# Altium schematic sheet 密码球锁202061.Schdoc
size A2; SheetNumber: 0; SheetTotal: 0
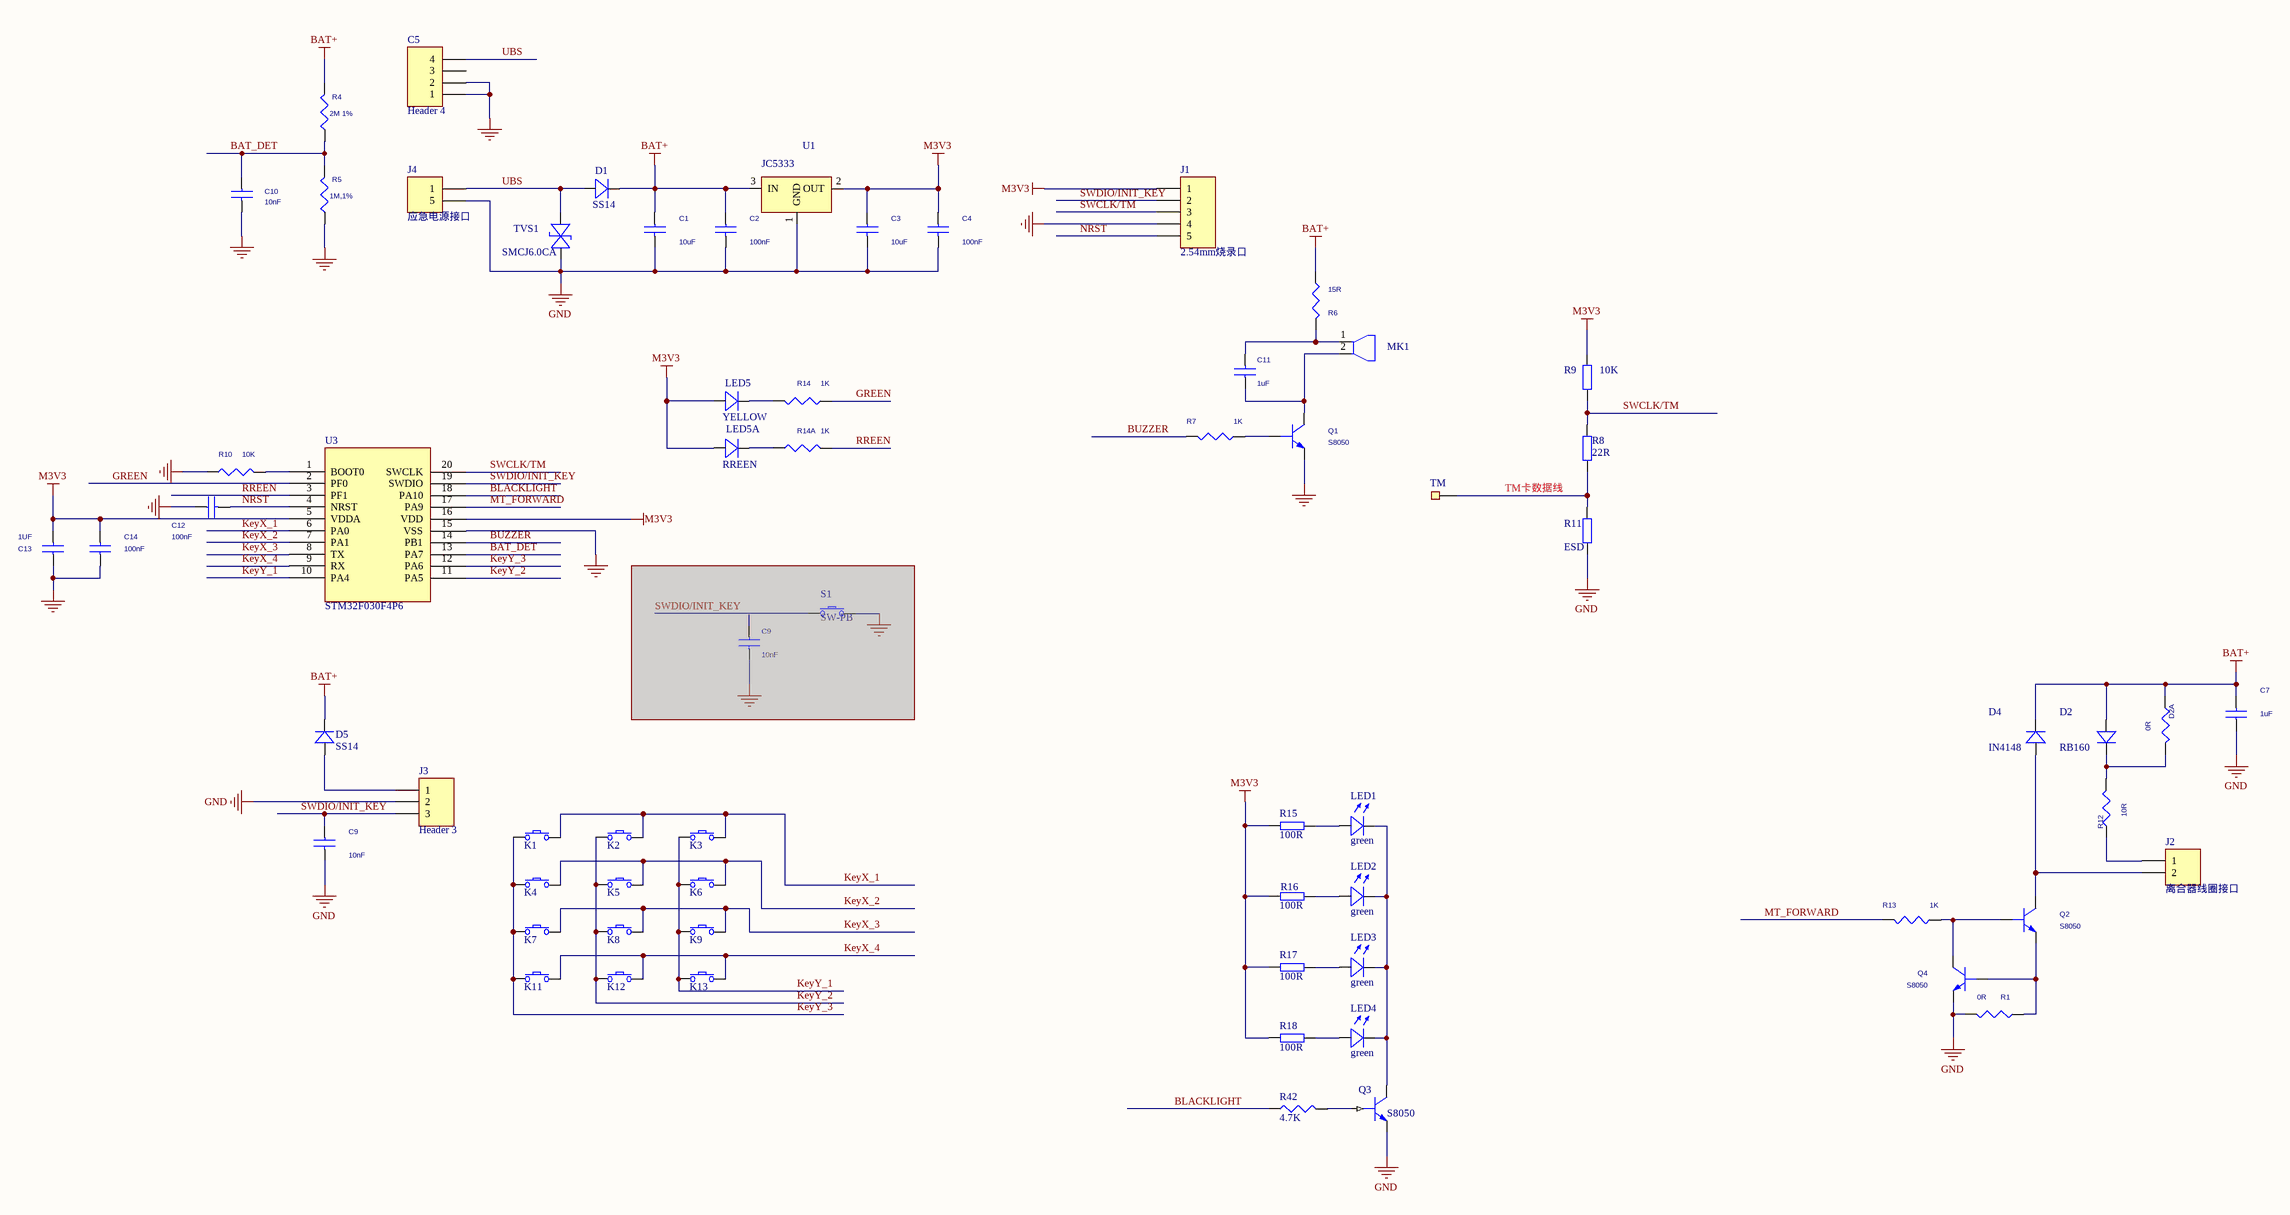
[diagram p0: 密码球锁202061.Schdoc]

## Parts
(Parts that share a designator on the sheet are numbered #1, #2 ... from top to bottom, then left to right.)
C1  10uF  [C0603]
C2  100nF  [C0603]
C3  10uF  [C0603]
C4  100nF  [C0603]
C5  Header 4  [DC_4P_4.5]
C7  1uF  [C0603]
C9#1  10nF  [C0603]  (masked out: inside a compile mask, not in the netlist)
C9#2  10nF  [C0603]
C10  10nF  [C0603]
C11  1uF  [C0603]
C12  100nF  [C0603]
C13  1UF  [C0603]
C14  100nF  [C0603]
D1  SS14  [DO-214AC(SMA)]
D2  RB160  [DO-214AC(SMA)]
D2A  0R  [1206R]
D4  IN4148  [DO-214AC(SMA)]
D5  SS14  [DO-214AC(SMA)]
J1  2.54mm烧录口  [5P-2.54]
J2  离合器线圈接口  [2PIN-2.0]
J3  Header 3  [3PIN-2.0J]
J4  应急电源接口  [HDR1X2]
K1  SW  [KEY_4_4_1.5]  (value not drawn)
K2  SW  [KEY_4_4_1.5]  (value not drawn)
K3  SW  [KEY_4_4_1.5]  (value not drawn)
K4  SW  [KEY_4_4_1.5]  (value not drawn)
K5  SW  [KEY_4_4_1.5]  (value not drawn)
K6  SW  [KEY_4_4_1.5]  (value not drawn)
K7  SW  [KEY_4_4_1.5]  (value not drawn)
K8  SW  [KEY_4_4_1.5]  (value not drawn)
K9  SW  [KEY_4_4_1.5]  (value not drawn)
K11  SW  [KEY_4_4_1.5]  (value not drawn)
K12  SW  [KEY_4_4_1.5]  (value not drawn)
K13  SW  [KEY_4_4_1.5]  (value not drawn)
LED1  green  [LED0603]
LED2  green  [LED0603]
LED3  green  [LED0603]
LED4  green  [LED0603]
LED5  YELLOW  [LED0603]
LED5A  RREEN  [LED0603]
MK1  BUZZER  [BUZZER_D93_L40]  (value not drawn)
Q1  S8050  [SOT-23]
Q2  S8050  [SOT-23]
Q3  S8050  [SOT-23]
Q4  S8050  [SOT-23]
R1  0R  [R0603]
R4  2M 1%  [R0603]
R5  1M,1%  [R0603]
R6  15R  [R0603]
R7  1K  [R0603]
R8  22R  [R0603]
R9  10K  [R0603]
R10  10K  [R0603]
R11  ESD  [R0603]
R12  10R  [R0603]
R13  1K  [R0603]
R14  1K  [R0603]
R14A  1K  [R0603]
R15  100R  [R0603]
R16  100R  [R0603]
R17  100R  [R0603]
R18  100R  [R0603]
R42  4.7K  [R0603]
S1  SW-PB  [KEY-S]  (masked out: inside a compile mask, not in the netlist)
TM  (no value)  [TOUCH]
TVS1  SMCJ6.0CA  [SMC/DO-214AB-XIAO]
U1  JC5333  [SOT-23-3L]
U3  STM32F030F4P6  [STM32F030F4]

## Nets
BAT+: C1.1 C2.1 C7.2 D1.2(K) D2.1(A) D2A.1 D4.2(K) D5.2(K) R4.2 R6.1 U1.3(IN)
GND: C1.2 C2.2 C3.2 C4.2 C5.1 C5.2 C7.1 C9#2.2 C10.2 C12.1 C13.1 C14.1 J1.4 J3.2 J4.5 Q1.2(EMITTER) Q3.2(EMITTER) Q4.2(EMITTER) R1.2 R5.1 R10.1 R11.1 TVS1.2 U1.1(GND) U3.15(VSS)
M3V3: C3.1 C4.1 C13.2 C14.2 J1.1 LED5.1(A) LED5A.1(A) R9.2 R15.1 R16.1 R17.1 R18.2 U1.2(OUT) U3.5(VDDA) U3.16(VDD)
BAT_DET: C10.1 R4.1 R5.2 U3.13(PA7)
BLACKLIGHT: R42.1 U3.18(PA10)
BUZZER: R7.2 U3.14(PB1)
GREEN: R14.1 U3.2(PF0)
KeyX_1: K1.3 K2.3 K3.3 U3.6(PA0)
KeyX_2: K4.3 K5.3 K6.3 U3.7(PA1)
KeyX_3: K7.3 K8.3 K9.3 U3.8(TX)
KeyX_4: K11.3 K12.4 K13.4 U3.9(RX)
KeyY_1: K3.1 K6.1 K9.1 K13.1 U3.10(PA4)
KeyY_2: K2.1 K5.1 K8.1 K12.2 U3.11(PA5)
KeyY_3: K1.1 K4.1 K7.1 K11.1 U3.12(PA6)
MT_FORWARD: R13.2 U3.17(PA9)
NRST: C12.2 J1.5 U3.4(NRST)
RREEN: R14A.2 U3.3(PF1)
SWCLK/TM: J1.3 R8.2 R9.1 U3.20(SWCLK)
SWDIO/INIT_KEY: C9#2.1 J1.2 J3.3 U3.19(SWDIO)
TM卡数据线: R8.1 R11.2 TM.1
UBS: C5.4 D1.1(A) J4.1 TVS1.1
NetC11_1: C11.1 MK1.2 Q1.3(COLLECTOR)
NetC11_2: C11.2 MK1.1 R6.2
NetD2_2: D2.2(K) D2A.2 R12.2
NetD4_1: D4.1(A) J2.2 Q2.3(COLLECTOR)
NetD5_1: D5.1(A) J3.1
NetJ2_1: J2.1 R12.1
NetLED1_1: LED1.1(A) R15.2
NetLED1_2: LED1.2(K) LED2.2(K) LED3.2(K) LED4.2(K) Q3.3(COLLECTOR)
NetLED2_1: LED2.1(A) R16.2
NetLED3_1: LED3.1(A) R17.2
NetLED4_1: LED4.1(A) R18.1
NetLED5_2: LED5.2(K) R14.2
NetLED5A_2: LED5A.2(K) R14A.1
NetQ1_1: Q1.1(B) R7.1
NetQ2_1: Q2.1(B) Q4.3(COLLECTOR) R13.1
NetQ2_2: Q2.2(EMITTER) Q4.1(B) R1.1
NetQ3_1: Q3.1(BASE) R42.2
NetR10_2: R10.2 U3.1(BOOT0)

Not connected (* = marked no-connect by the designer): C5 3

## Library data of the parts
C1-C4 C7 C9#1 C9#2 C12-C14 = CAP NP
C5 = Header 4: Header, 4-Pin; LatestRevisionDate: 17-Jul-2002; LatestRevisionNote: Re-released for DXP Platform.; Publisher: Altium Limited
C10 = C_0: ?
C11 = C_0_Dup1
D1 D2 D4 D5 LED5 LED5A = D
D2A R12 = Res0603
J1 = Header 5: Header, 5-Pin; LatestRevisionDate: 17-Jul-2002; LatestRevisionNote: Re-released for DXP Platform.; Publisher: Altium Limited
J2 J4 = Header 2: Header, 2-Pin; LatestRevisionDate: 17-Jul-2002; LatestRevisionNote: Re-released for DXP Platform.; Publisher: Altium Limited
J3 = Header 3: Header, 3-Pin; LatestRevisionDate: 17-Jul-2002; LatestRevisionNote: Re-released for DXP Platform.; Publisher: Altium Limited
K1-K9 K11-K13 S1 = SW: Switch
LED1-LED4 = LED
MK1 = MICROPHONE_0
Q1 Q2 Q4 = PMBT3904_Dup1: OriginalSymbolOrigin: (0,0); ROOM: power
Q3 = PMBT3904
R1 R6 R7 R10 R13 R14 R14A = R_Dup1
R4 R5 = R_Dup2
R8 R9 R11 = Res2: Resistor; Value: 1K; Published: 2013年12月24日; LatestRevisionDate: 2013年12月24日; LatestRevisionNote: Re-released for DXP Platform.
R15-R18 R42 = R
TM = TOUCH-BELL
TVS1 = TVS
U1 = XC6206P302M
U3 = Component_1